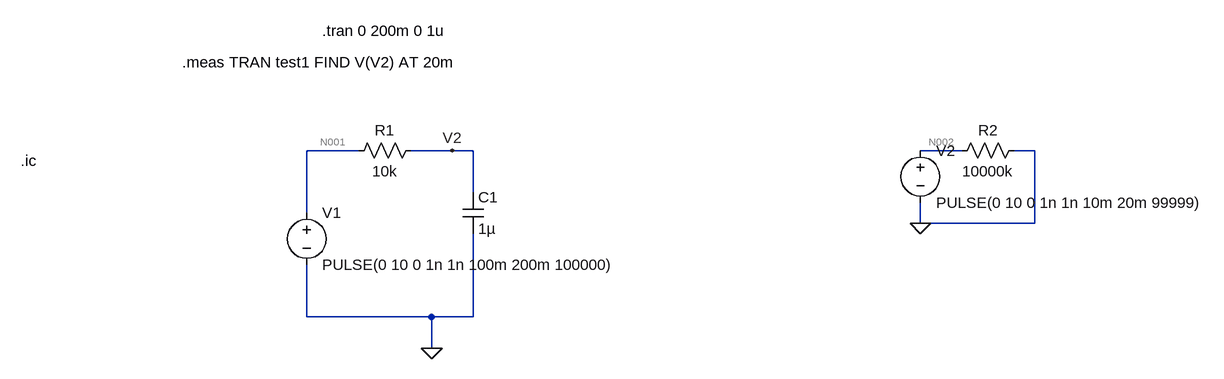
[diagram p0: schematic Question 1.asc]
Question 1.asc, the LTspice schematic file:
Version 4
SHEET 1 1456 680
WIRE 128 224 48 224
WIRE 272 224 208 224
WIRE 304 224 272 224
WIRE 1056 224 992 224
WIRE 1168 224 1136 224
WIRE 304 288 304 224
WIRE 48 320 48 224
WIRE 992 336 992 304
WIRE 1168 336 1168 224
WIRE 1168 336 992 336
WIRE 48 480 48 400
WIRE 240 480 48 480
WIRE 304 480 304 352
WIRE 304 480 240 480
WIRE 240 528 240 480
FLAG 240 528 0
FLAG 272 224 V2
FLAG 992 336 0
SYMBOL voltage 48 304 R0
WINDOW 123 0 0 Left 0
WINDOW 39 0 0 Left 0
SYMATTR InstName V1
SYMATTR Value PULSE(0 10 0 1n 1n 100m 200m 100000)
SYMBOL res 224 208 R90
WINDOW 0 0 56 VBottom 2
WINDOW 3 32 56 VTop 2
SYMATTR InstName R1
SYMATTR Value 10k
SYMBOL cap 288 288 R0
SYMATTR InstName C1
SYMATTR Value 1µ
SYMBOL voltage 992 208 R0
WINDOW 123 0 0 Left 0
WINDOW 39 0 0 Left 0
SYMATTR InstName V2
SYMATTR Value PULSE(0 10 0 1n 1n 10m 20m 99999)
SYMBOL res 1152 208 R90
WINDOW 0 0 56 VBottom 2
WINDOW 3 32 56 VTop 2
SYMATTR InstName R2
SYMATTR Value 10000k
TEXT 72 40 Left 2 !.tran 0 200m 0 1u
TEXT -144 88 Left 2 !.meas TRAN test1 FIND V(V2) AT 20m
TEXT -392 240 Left 2 !.ic

The netlist it stands for:
* Question 1.asc
V1 N001 0 PULSE(0 10 0 1n 1n 100m 200m 100000)
R1 V2 N001 10k
C1 V2 0 1µ
V2 N002 0 PULSE(0 10 0 1n 1n 10m 20m 99999)
R2 0 N002 10000k
.tran 0 200m 0 1u
.meas TRAN test1 FIND V(V2) AT 20m
.ic
.backanno
.end

* Results of the author's LTspice run, read from the files saved beside the schematic
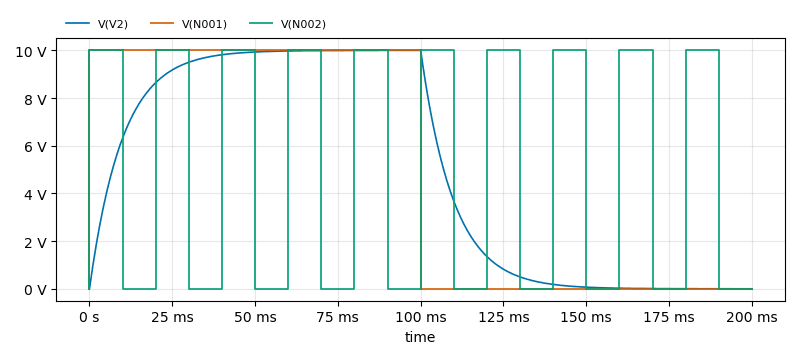
[diagram p1: Transient Analysis of Question 1.asc, plotted from the saved traces]
* Transient Analysis, 1 run:
*   V(V2): min 0 V, max 10 V, average 5 V, rms 6.709 V, last 454 µV
*   V(N001): min 0 V, max 10 V, average 5 V, rms 7.071 V, last 0 V
*   V(N002): min 0 V, max 10 V, average 5 V, rms 7.071 V, last 0 V
* From the log:
*   test1: v(v2)=8.64665 at 0.02